# Altium schematic sheet alimentación.SchDoc
size A4; SheetNumber: 3; SheetTotal: 5; SPICEModelCacheNBWNHLZJ: <root> / <DocumentId>NBWNHLZJ</DocumentId> / <CacheFrame Number="0"> / <Model Name="pnp" Kind="MDL"> / <Text>*Default PNP BJT / *PNP Trans Pinout: C,B,E / .MODEL PNP PNP()</Text> / </Model> / </CacheFrame> / </root>
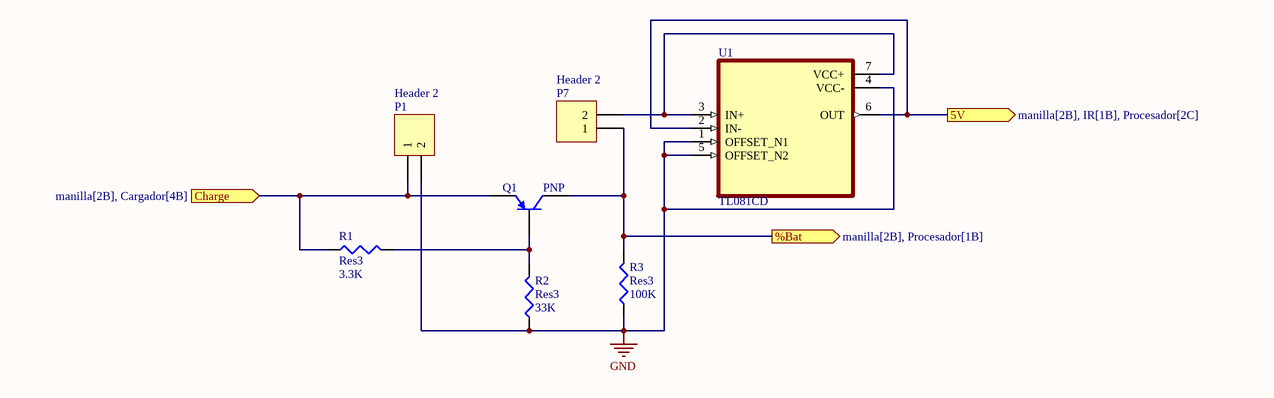
[diagram p0: alimentación.SchDoc]

## Parts
P1  Header 2  [HDR1X2]
P7  Header 2  [HDR1X2]
Q1  PNP  [SOT-23B_M]
R1  Res3  value 3.3K  [J1-0603]
R2  Res3  value 33K  [J1-0603]
R3  Res3  value 100K  [J1-0603]
U1  TL081CD  [SOIC127P599X175-8N]

## Ports
5V (out, see manilla[2B], IR[1B], Procesador[2C]), %Bat (out, see manilla[2B], Procesador[1B]), Charge (in, see manilla[2B], Cargador[4B])

## Nets
GND: P1.2 R2.1 R3.1 U1.1(OFFSET_N1) U1.4(VCC-) U1.5(OFFSET_N2)
5V: U1.2(IN-) U1.6(OUT) ; port 5V
%Bat: P7.1 Q1.1(C) R3.2 ; port %Bat
Charge: P1.1 Q1.3(E) R1.1 ; port Charge
NetP7_2: P7.2 U1.3(IN+) U1.7(VCC+)
NetQ1_2: Q1.2(B) R1.2 R2.2

## Library data of the parts
P1 P7 = Header 2: Header, 2-Pin; LatestRevisionDate: 17-Jul-2002; LatestRevisionNote: Re-released for DXP Platform.; Publisher: Altium Limited
Q1 = PNP: PNP Bipolar Transistor; Published: 8-Jun-2000; LatestRevisionDate: 29-May-2009; LatestRevisionNote: IPC-7351 Footprint Added.; PackageVersion: Aug-1999; PackageReference: SOT-23B; Publisher: Altium Limited; PackageDescription: 3-Pin SOT-23 Package 0.95 mm Pitch, 2.4 mm Lead Span
R1-R3 = Res3: Resistor; Published: 8-Jun-2000; LatestRevisionDate: 29-May-2009; LatestRevisionNote: IPC-7351 Footprint Added.; PackageReference: J1-0603; Publisher: Altium Limited; PackageDescription: Chip Resistor
U1 = TL081CD: High Slew Rate JFET-Input Operational Amplifier 8-SOIC 0 to 70; MF: Texas Instruments; Package: SOIC-8 Texas Instruments; SnapEDA_Link: https://www.snapeda.com/parts/TL081CD/Texas%20Instruments/view-part/4793911/?ref=snap; MP: TL081CD; Availability: Good; Price: None; Value: *; Purchase-URL: https://pricing.snapeda.com/search/part/TL081CD/?ref=eda